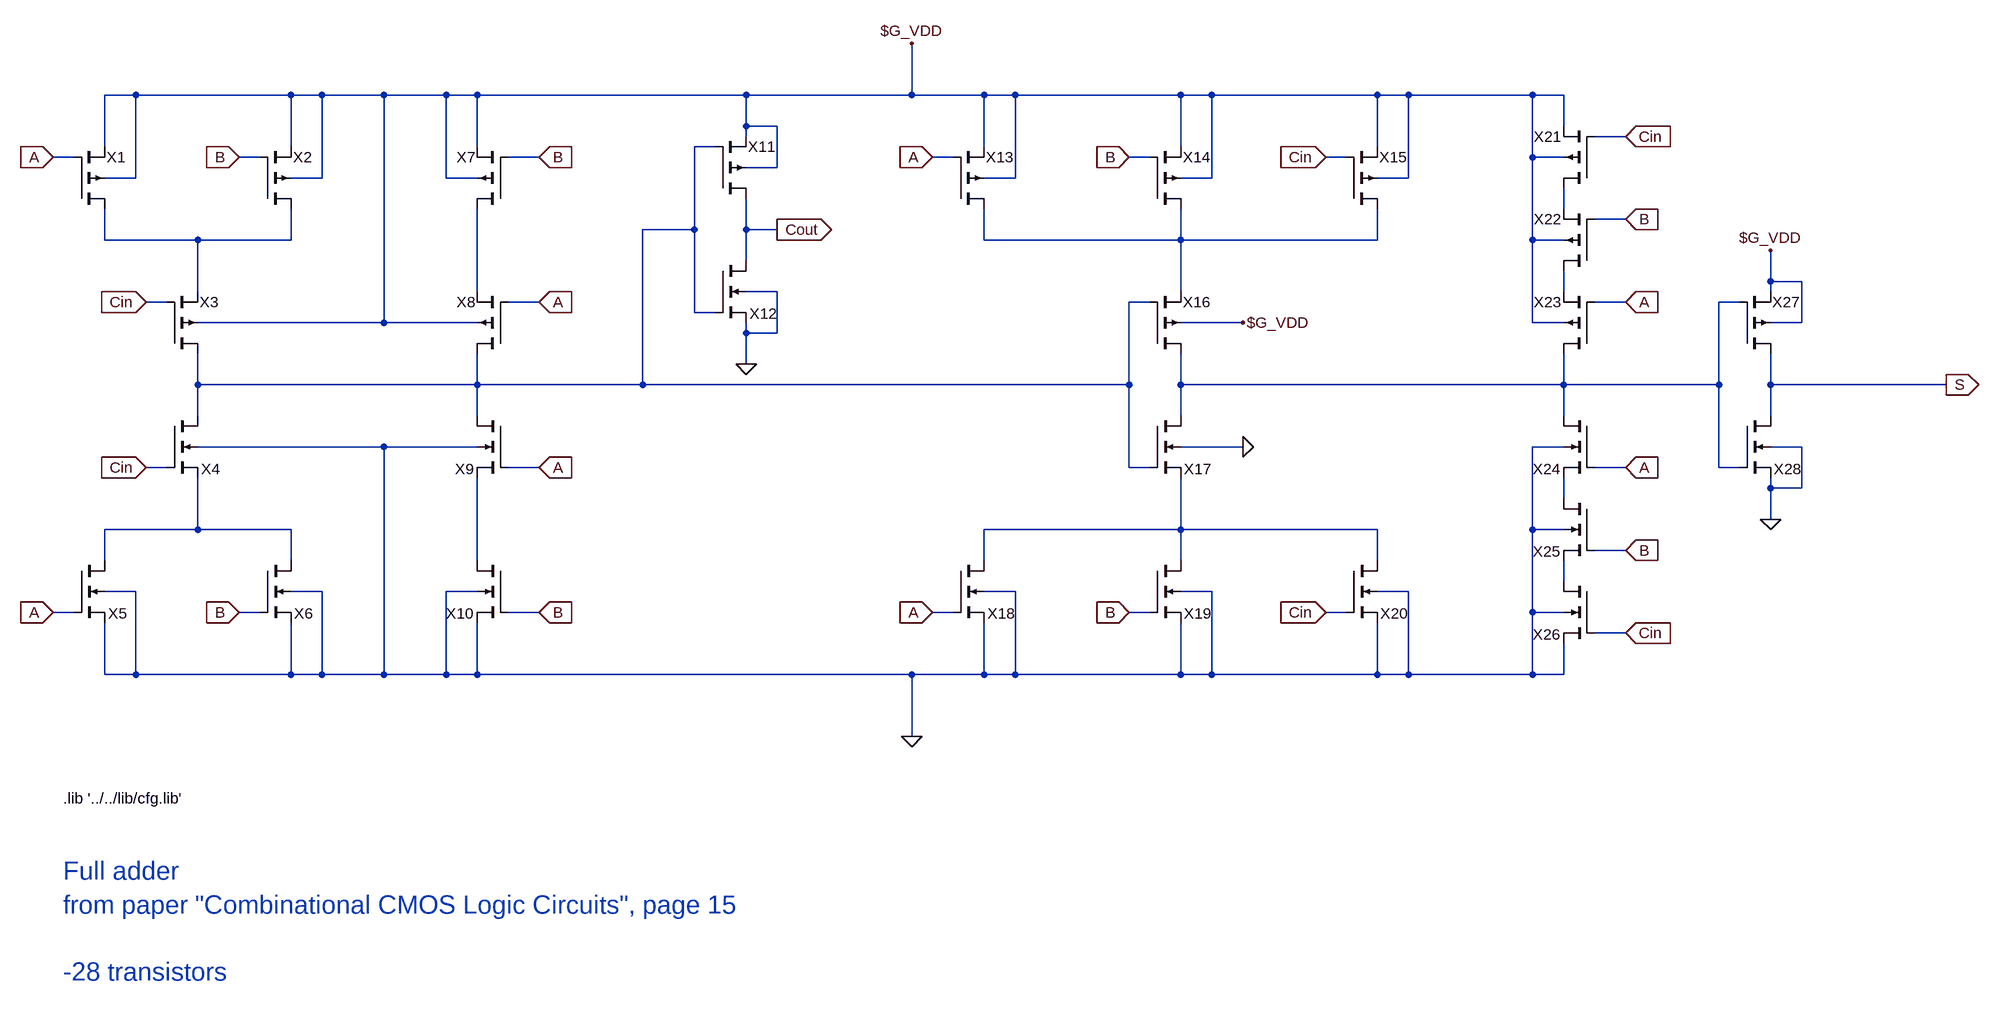
[diagram p0: schematic fa1.asc]
fa1.asc, the LTspice schematic file:
Version 4
SHEET 1 2652 1124
WIRE -224 -336 -272 -336
WIRE 16 -336 -224 -336
WIRE 64 -336 16 -336
WIRE 160 -336 64 -336
WIRE 256 -336 160 -336
WIRE 304 -336 256 -336
WIRE 720 -336 304 -336
WIRE 976 -336 976 -416
WIRE 976 -336 720 -336
WIRE 1088 -336 976 -336
WIRE 1136 -336 1088 -336
WIRE 1392 -336 1136 -336
WIRE 1440 -336 1392 -336
WIRE 1696 -336 1440 -336
WIRE 1744 -336 1696 -336
WIRE 1936 -336 1744 -336
WIRE 1984 -336 1936 -336
WIRE 720 -288 720 -336
WIRE 768 -288 720 -288
WIRE 1984 -288 1984 -336
WIRE 720 -272 720 -288
WIRE 2080 -272 2032 -272
WIRE -272 -256 -272 -336
WIRE 16 -256 16 -336
WIRE 304 -256 304 -336
WIRE 672 -256 640 -256
WIRE 1088 -256 1088 -336
WIRE 1392 -256 1392 -336
WIRE 1696 -256 1696 -336
WIRE -320 -240 -352 -240
WIRE -32 -240 -64 -240
WIRE 400 -240 352 -240
WIRE 1040 -240 1008 -240
WIRE 1344 -240 1312 -240
WIRE 1648 -240 1616 -240
WIRE 1936 -240 1936 -336
WIRE 1984 -240 1936 -240
WIRE 768 -224 768 -288
WIRE 768 -224 720 -224
WIRE -224 -208 -224 -336
WIRE -224 -208 -272 -208
WIRE 64 -208 64 -336
WIRE 64 -208 16 -208
WIRE 256 -208 256 -336
WIRE 304 -208 256 -208
WIRE 1136 -208 1136 -336
WIRE 1136 -208 1088 -208
WIRE 1440 -208 1440 -336
WIRE 1440 -208 1392 -208
WIRE 1744 -208 1744 -336
WIRE 1744 -208 1696 -208
WIRE 1984 -160 1984 -192
WIRE 2080 -144 2032 -144
WIRE 640 -128 640 -256
WIRE 640 -128 560 -128
WIRE 720 -128 720 -176
WIRE 768 -128 720 -128
WIRE -272 -112 -272 -160
WIRE -128 -112 -272 -112
WIRE 16 -112 16 -160
WIRE 16 -112 -128 -112
WIRE 1088 -112 1088 -160
WIRE 1392 -112 1392 -160
WIRE 1392 -112 1088 -112
WIRE 1696 -112 1696 -160
WIRE 1696 -112 1392 -112
WIRE 1936 -112 1936 -240
WIRE 1984 -112 1936 -112
WIRE 720 -80 720 -128
WIRE 2304 -48 2304 -96
WIRE 2352 -48 2304 -48
WIRE -128 -32 -128 -112
WIRE 304 -32 304 -160
WIRE 768 -32 720 -32
WIRE 1392 -32 1392 -112
WIRE 1984 -32 1984 -64
WIRE 2304 -32 2304 -48
WIRE -176 -16 -208 -16
WIRE 400 -16 352 -16
WIRE 1344 -16 1312 -16
WIRE 2080 -16 2032 -16
WIRE 2256 -16 2224 -16
WIRE 640 0 640 -128
WIRE 672 0 640 0
WIRE 160 16 160 -336
WIRE 160 16 -128 16
WIRE 304 16 160 16
WIRE 1488 16 1392 16
WIRE 1936 16 1936 -112
WIRE 1984 16 1936 16
WIRE 2352 16 2352 -48
WIRE 2352 16 2304 16
WIRE 720 32 720 16
WIRE 768 32 768 -32
WIRE 768 32 720 32
WIRE 720 80 720 32
WIRE -128 112 -128 64
WIRE 304 112 304 64
WIRE 304 112 -128 112
WIRE 560 112 560 -128
WIRE 560 112 304 112
WIRE 1312 112 1312 -16
WIRE 1312 112 560 112
WIRE 1392 112 1392 64
WIRE 1984 112 1984 64
WIRE 1984 112 1392 112
WIRE 2224 112 2224 -16
WIRE 2224 112 1984 112
WIRE 2304 112 2304 64
WIRE 2576 112 2304 112
WIRE -128 160 -128 112
WIRE 304 160 304 112
WIRE 1392 160 1392 112
WIRE 1984 160 1984 112
WIRE 2304 160 2304 112
WIRE 160 208 -128 208
WIRE 304 208 160 208
WIRE 1488 208 1392 208
WIRE 1984 208 1936 208
WIRE 2352 208 2304 208
WIRE -176 240 -208 240
WIRE 400 240 352 240
WIRE 1312 240 1312 112
WIRE 1344 240 1312 240
WIRE 2080 240 2032 240
WIRE 2224 240 2224 112
WIRE 2256 240 2224 240
WIRE 2304 272 2304 256
WIRE 2352 272 2352 208
WIRE 2352 272 2304 272
WIRE 1984 288 1984 256
WIRE 2304 320 2304 272
WIRE -128 336 -128 256
WIRE -128 336 -272 336
WIRE 16 336 -128 336
WIRE 1392 336 1392 256
WIRE 1392 336 1088 336
WIRE 1696 336 1392 336
WIRE 1936 336 1936 208
WIRE 1984 336 1936 336
WIRE 2080 368 2032 368
WIRE -272 384 -272 336
WIRE 16 384 16 336
WIRE 304 384 304 256
WIRE 1088 384 1088 336
WIRE 1392 384 1392 336
WIRE 1696 384 1696 336
WIRE 1984 416 1984 384
WIRE -224 432 -272 432
WIRE 64 432 16 432
WIRE 304 432 256 432
WIRE 1136 432 1088 432
WIRE 1440 432 1392 432
WIRE 1744 432 1696 432
WIRE -320 464 -352 464
WIRE -32 464 -64 464
WIRE 400 464 352 464
WIRE 1040 464 1008 464
WIRE 1344 464 1312 464
WIRE 1648 464 1616 464
WIRE 1936 464 1936 336
WIRE 1984 464 1936 464
WIRE 2080 496 2032 496
WIRE -272 560 -272 480
WIRE -224 560 -224 432
WIRE -224 560 -272 560
WIRE 16 560 16 480
WIRE 16 560 -224 560
WIRE 64 560 64 432
WIRE 64 560 16 560
WIRE 160 560 160 208
WIRE 160 560 64 560
WIRE 256 560 256 432
WIRE 256 560 160 560
WIRE 304 560 304 480
WIRE 304 560 256 560
WIRE 976 560 304 560
WIRE 1088 560 1088 480
WIRE 1088 560 976 560
WIRE 1136 560 1136 432
WIRE 1136 560 1088 560
WIRE 1392 560 1392 480
WIRE 1392 560 1136 560
WIRE 1440 560 1440 432
WIRE 1440 560 1392 560
WIRE 1696 560 1696 480
WIRE 1696 560 1440 560
WIRE 1744 560 1744 432
WIRE 1744 560 1696 560
WIRE 1936 560 1936 464
WIRE 1936 560 1744 560
WIRE 1984 560 1984 512
WIRE 1984 560 1936 560
WIRE 976 656 976 560
FLAG -352 -240 A
IOPIN -352 -240 In
FLAG -208 -16 Cin
IOPIN -208 -16 In
FLAG -64 -240 B
IOPIN -64 -240 In
FLAG 400 -240 B
IOPIN 400 -240 In
FLAG 400 -16 A
IOPIN 400 -16 In
FLAG -208 240 Cin
IOPIN -208 240 In
FLAG -352 464 A
IOPIN -352 464 In
FLAG -64 464 B
IOPIN -64 464 In
FLAG 400 240 A
IOPIN 400 240 In
FLAG 400 464 B
IOPIN 400 464 In
FLAG 768 -128 Cout
IOPIN 768 -128 Out
FLAG 720 80 0
FLAG 1008 -240 A
IOPIN 1008 -240 In
FLAG 1616 -240 Cin
IOPIN 1616 -240 In
FLAG 1008 464 A
IOPIN 1008 464 In
FLAG 1616 464 Cin
IOPIN 1616 464 In
FLAG 1312 -240 B
IOPIN 1312 -240 In
FLAG 1312 464 B
IOPIN 1312 464 In
FLAG 2080 -272 Cin
IOPIN 2080 -272 In
FLAG 2080 -144 B
IOPIN 2080 -144 In
FLAG 2080 -16 A
IOPIN 2080 -16 In
FLAG 2080 496 Cin
IOPIN 2080 496 In
FLAG 2080 368 B
IOPIN 2080 368 In
FLAG 2080 240 A
IOPIN 2080 240 In
FLAG 2576 112 S
IOPIN 2576 112 Out
FLAG 2304 -96 $G_VDD
FLAG 2304 320 0
FLAG 1488 16 $G_VDD
FLAG 1488 208 0
FLAG 976 -416 $G_VDD
FLAG 976 656 0
SYMBOL pmos4 -320 -160 M180
WINDOW 0 51 80 Left 2
WINDOW 3 52 23 Invisible 2
SYMATTR InstName X1
SYMATTR Value pmos_t1
SYMATTR Prefix X
SYMBOL pmos4 -176 64 M180
WINDOW 0 51 80 Left 2
WINDOW 3 52 23 Invisible 2
SYMATTR InstName X3
SYMATTR Value pmos_t1
SYMATTR Prefix X
SYMBOL pmos4 -32 -160 M180
WINDOW 0 51 80 Left 2
WINDOW 3 52 23 Invisible 2
SYMATTR InstName X2
SYMATTR Value pmos_t1
SYMATTR Prefix X
SYMBOL pmos4 352 -160 R180
WINDOW 0 51 80 Left 2
WINDOW 3 52 23 Invisible 2
SYMATTR InstName X7
SYMATTR Value pmos_t1
SYMATTR Prefix X
SYMBOL pmos4 352 64 R180
WINDOW 0 51 80 Left 2
WINDOW 3 52 23 Invisible 2
SYMATTR InstName X8
SYMATTR Value pmos_t1
SYMATTR Prefix X
SYMBOL nmos4 -176 160 R0
WINDOW 0 53 82 Left 2
WINDOW 3 53 23 Invisible 2
SYMATTR InstName X4
SYMATTR Value nmos_t1
SYMATTR Prefix X
SYMBOL nmos4 -320 384 R0
WINDOW 0 53 82 Left 2
WINDOW 3 53 23 Invisible 2
SYMATTR InstName X5
SYMATTR Value nmos_t1
SYMATTR Prefix X
SYMBOL nmos4 -32 384 R0
WINDOW 0 53 82 Left 2
WINDOW 3 53 23 Invisible 2
SYMATTR InstName X6
SYMATTR Value nmos_t1
SYMATTR Prefix X
SYMBOL nmos4 352 160 M0
WINDOW 0 53 82 Left 2
WINDOW 3 53 23 Invisible 2
SYMATTR InstName X9
SYMATTR Value nmos_t1
SYMATTR Prefix X
SYMBOL nmos4 352 384 M0
WINDOW 0 53 82 Left 2
WINDOW 3 53 23 Invisible 2
SYMATTR InstName X10
SYMATTR Value nmos_t1
SYMATTR Prefix X
SYMBOL pmos4 672 -176 M180
WINDOW 0 51 80 Left 2
WINDOW 3 52 23 Invisible 2
SYMATTR InstName X11
SYMATTR Value pmos_t1
SYMATTR Prefix X
SYMBOL nmos4 672 -80 R0
WINDOW 0 53 82 Left 2
WINDOW 3 53 23 Invisible 2
SYMATTR InstName X12
SYMATTR Value nmos_t1
SYMATTR Prefix X
SYMBOL pmos4 1040 -160 M180
WINDOW 0 51 80 Left 2
WINDOW 3 52 23 Invisible 2
SYMATTR InstName X13
SYMATTR Value pmos_t1
SYMATTR Prefix X
SYMBOL pmos4 1344 64 M180
WINDOW 0 51 80 Left 2
WINDOW 3 52 23 Invisible 2
SYMATTR InstName X16
SYMATTR Value pmos_t1
SYMATTR Prefix X
SYMBOL pmos4 1648 -160 M180
WINDOW 0 51 80 Left 2
WINDOW 3 52 23 Invisible 2
SYMATTR InstName X15
SYMATTR Value pmos_t1
SYMATTR Prefix X
SYMBOL nmos4 1344 160 R0
WINDOW 0 53 82 Left 2
WINDOW 3 53 23 Invisible 2
SYMATTR InstName X17
SYMATTR Value nmos_t1
SYMATTR Prefix X
SYMBOL nmos4 1040 384 R0
WINDOW 0 53 82 Left 2
WINDOW 3 53 23 Invisible 2
SYMATTR InstName X18
SYMATTR Value nmos_t1
SYMATTR Prefix X
SYMBOL nmos4 1648 384 R0
WINDOW 0 53 82 Left 2
WINDOW 3 53 23 Invisible 2
SYMATTR InstName X20
SYMATTR Value nmos_t1
SYMATTR Prefix X
SYMBOL pmos4 1344 -160 M180
WINDOW 0 51 80 Left 2
WINDOW 3 52 23 Invisible 2
SYMATTR InstName X14
SYMATTR Value pmos_t1
SYMATTR Prefix X
SYMBOL nmos4 1344 384 R0
WINDOW 0 53 82 Left 2
WINDOW 3 53 23 Invisible 2
SYMATTR InstName X19
SYMATTR Value nmos_t1
SYMATTR Prefix X
SYMBOL pmos4 2032 -192 R180
WINDOW 0 51 80 Left 2
WINDOW 3 52 23 Invisible 2
SYMATTR InstName X21
SYMATTR Value pmos_t1
SYMATTR Prefix X
SYMBOL pmos4 2032 -64 R180
WINDOW 0 51 80 Left 2
WINDOW 3 52 23 Invisible 2
SYMATTR InstName X22
SYMATTR Value pmos_t1
SYMATTR Prefix X
SYMBOL pmos4 2032 64 R180
WINDOW 0 51 80 Left 2
WINDOW 3 52 23 Invisible 2
SYMATTR InstName X23
SYMATTR Value pmos_t1
SYMATTR Prefix X
SYMBOL nmos4 2032 416 M0
WINDOW 0 53 82 Left 2
WINDOW 3 53 23 Invisible 2
SYMATTR InstName X26
SYMATTR Value nmos_t1
SYMATTR Prefix X
SYMBOL nmos4 2032 288 M0
WINDOW 0 53 82 Left 2
WINDOW 3 53 23 Invisible 2
SYMATTR InstName X25
SYMATTR Value nmos_t1
SYMATTR Prefix X
SYMBOL nmos4 2032 160 M0
WINDOW 0 53 82 Left 2
WINDOW 3 53 23 Invisible 2
SYMATTR InstName X24
SYMATTR Value nmos_t1
SYMATTR Prefix X
SYMBOL pmos4 2256 64 M180
WINDOW 0 51 80 Left 2
WINDOW 3 52 23 Invisible 2
SYMATTR InstName X27
SYMATTR Value pmos_t1
SYMATTR Prefix X
SYMBOL nmos4 2256 160 R0
WINDOW 0 53 82 Left 2
WINDOW 3 53 23 Invisible 2
SYMATTR InstName X28
SYMATTR Value nmos_t1
SYMATTR Prefix X
TEXT -336 752 Left 2 !.lib '../../lib/cfg.lib'
TEXT -336 864 Left 4 ;Full adder\nfrom paper "Combinational CMOS Logic Circuits", page 15\n \n-28 transistors

The netlist it stands for:
* fa1.asc
XX1 N003 A $G_VDD $G_VDD pmos_t1  ; pins D G S B
XX3 N001 Cin N003 $G_VDD pmos_t1  ; pins D G S B
XX2 N003 B $G_VDD $G_VDD pmos_t1  ; pins D G S B
XX7 N005 B $G_VDD $G_VDD pmos_t1  ; pins D G S B
XX8 N001 A N005 $G_VDD pmos_t1  ; pins D G S B
XX4 N001 Cin N009 0 nmos_t1  ; pins D G S B
XX5 N009 A 0 0 nmos_t1  ; pins D G S B
XX6 N009 B 0 0 nmos_t1  ; pins D G S B
XX9 N001 A N011 0 nmos_t1  ; pins D G S B
XX10 N011 B 0 0 nmos_t1  ; pins D G S B
XX11 Cout N001 $G_VDD $G_VDD pmos_t1  ; pins D G S B
XX12 Cout N001 0 0 nmos_t1  ; pins D G S B
XX13 N004 A $G_VDD $G_VDD pmos_t1  ; pins D G S B
XX16 N007 N001 N004 $G_VDD pmos_t1  ; pins D G S B
XX15 N004 Cin $G_VDD $G_VDD pmos_t1  ; pins D G S B
XX17 N007 N001 N010 0 nmos_t1  ; pins D G S B
XX18 N010 A 0 0 nmos_t1  ; pins D G S B
XX20 N010 Cin 0 0 nmos_t1  ; pins D G S B
XX14 N004 B $G_VDD $G_VDD pmos_t1  ; pins D G S B
XX19 N010 B 0 0 nmos_t1  ; pins D G S B
XX21 N002 Cin $G_VDD $G_VDD pmos_t1  ; pins D G S B
XX22 N006 B N002 $G_VDD pmos_t1  ; pins D G S B
XX23 N007 A N006 $G_VDD pmos_t1  ; pins D G S B
XX26 N012 Cin 0 0 nmos_t1  ; pins D G S B
XX25 N008 B N012 0 nmos_t1  ; pins D G S B
XX24 N007 A N008 0 nmos_t1  ; pins D G S B
XX27 S N007 $G_VDD $G_VDD pmos_t1  ; pins D G S B
XX28 S N007 0 0 nmos_t1  ; pins D G S B
.lib '../../lib/cfg.lib'
* Full adder
* from paper "Combinational CMOS Logic Circuits", page 15
* -28 transistors
.backanno
.end